# Altium schematic sheet power.SchDoc
size 381 x 241 mm; SheetNumber: 6; SheetTotal: 12
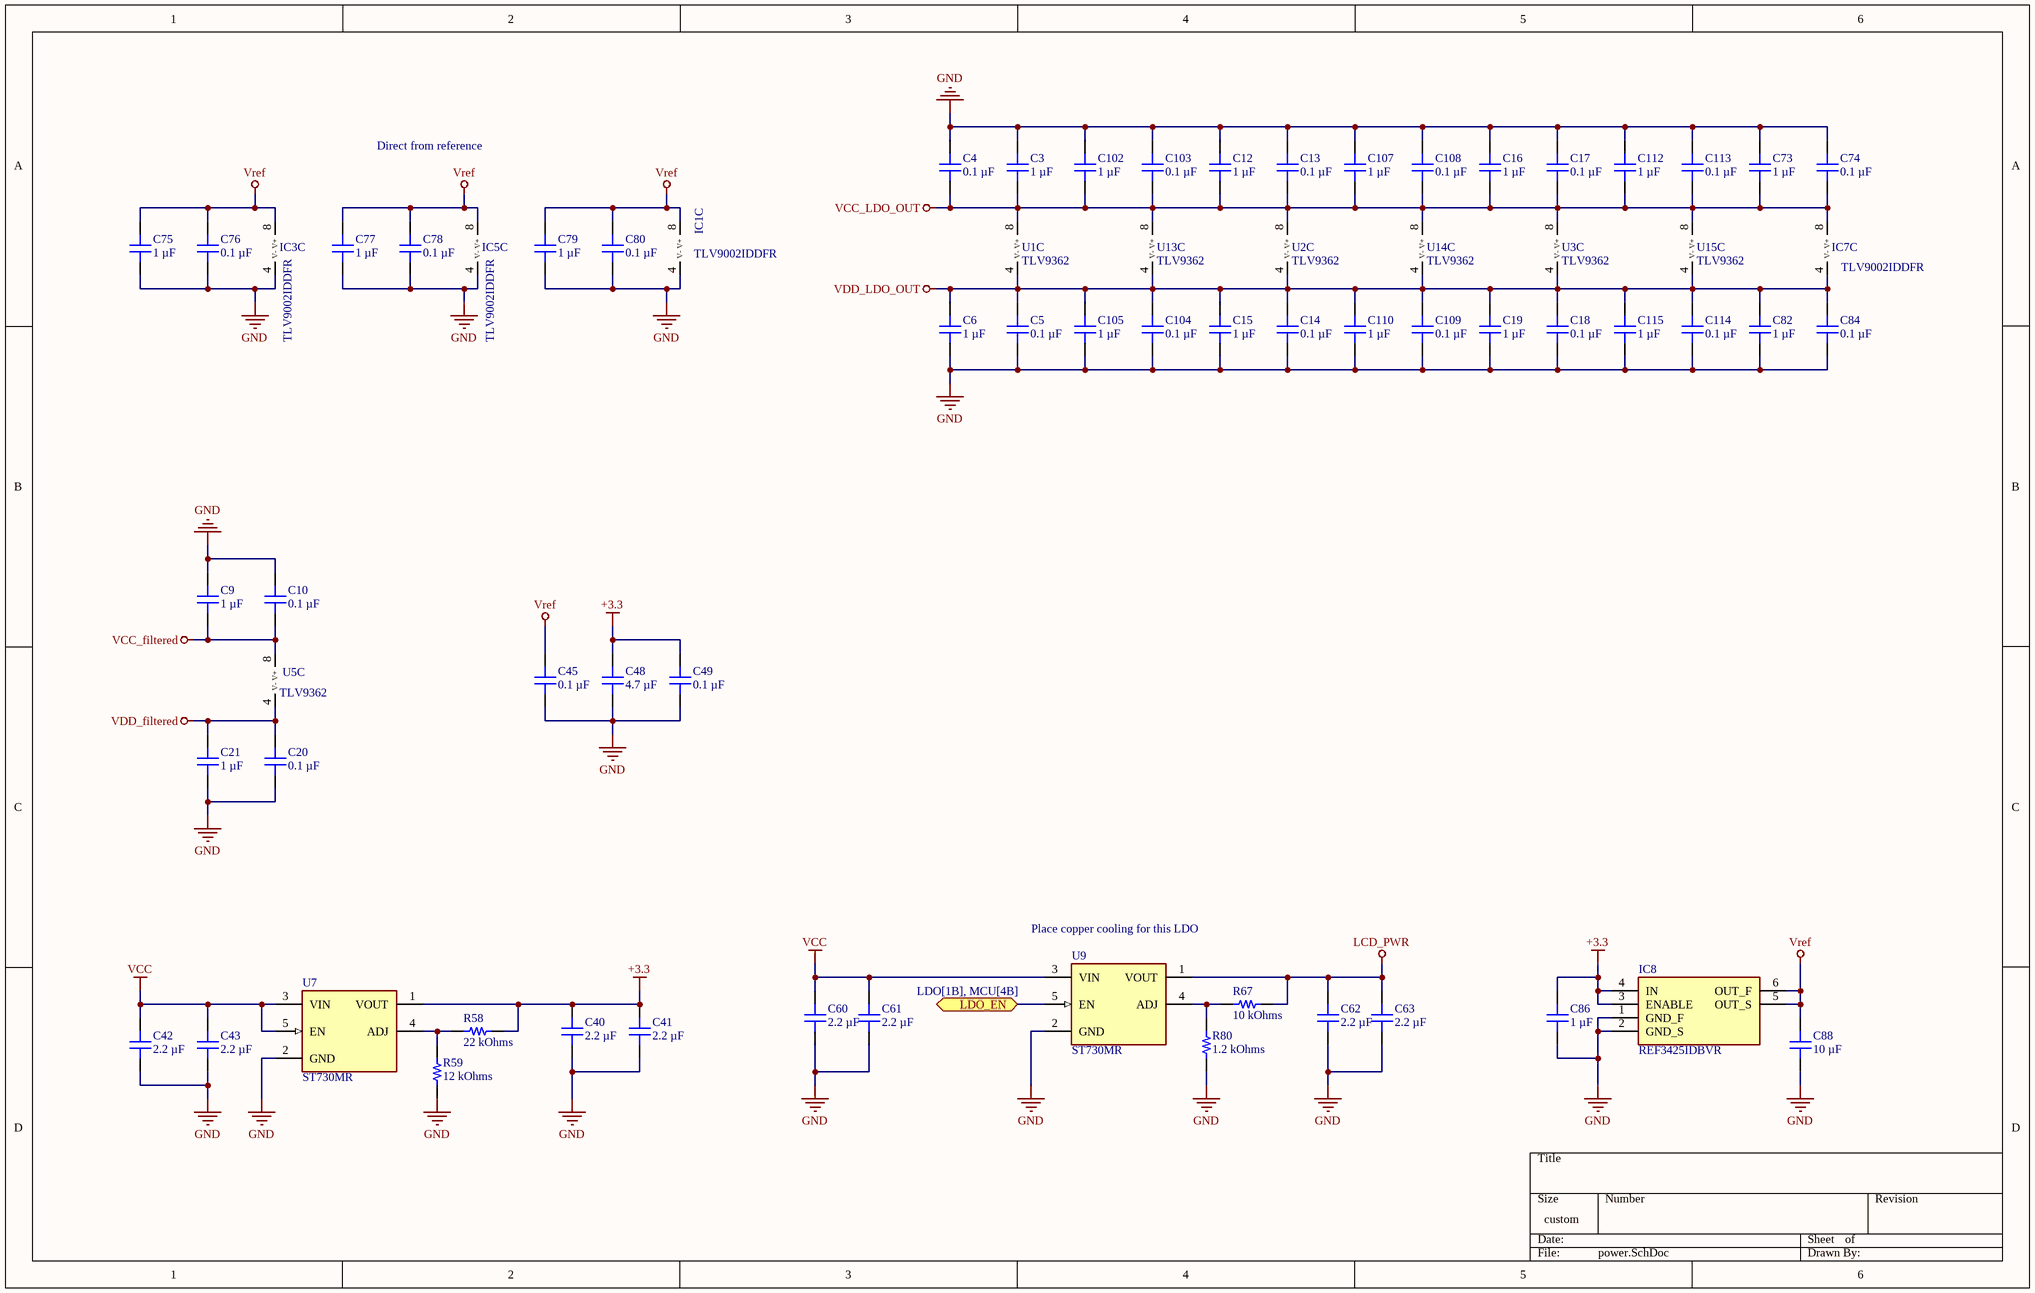
[diagram p0: power.SchDoc]

## Parts
C3  1 µF  [CAP 1206_3216 - 0.8MM]
C4  0.1 µF  [CAP 1206_3216 - 0.8MM]
C5  0.1 µF  [CAP 1206_3216 - 0.8MM]
C6  1 µF  [CAP 1206_3216 - 0.8MM]
C9  1 µF  [CAP 1206_3216 - 0.8MM]
C10  0.1 µF  [CAP 1206_3216 - 0.8MM]
C12  1 µF  [CAP 1206_3216 - 0.8MM]
C13  0.1 µF  [CAP 1206_3216 - 0.8MM]
C14  0.1 µF  [CAP 1206_3216 - 0.8MM]
C15  1 µF  [CAP 1206_3216 - 0.8MM]
C16  1 µF  [CAP 1206_3216 - 0.8MM]
C17  0.1 µF  [CAP 1206_3216 - 0.8MM]
C18  0.1 µF  [CAP 1206_3216 - 0.8MM]
C19  1 µF  [CAP 1206_3216 - 0.8MM]
C20  0.1 µF  [CAP 1206_3216 - 0.8MM]
C21  1 µF  [CAP 1206_3216 - 0.8MM]
C40  2.2 µF  [CAP 1206_3216 - 0.8MM]
C41  2.2 µF  [CAP 1206_3216 - 0.8MM]
C42  2.2 µF  [CAP 1206_3216 - 0.8MM]
C43  2.2 µF  [CAP 1206_3216 - 0.8MM]
C45  0.1 µF  [CAP 1206_3216 - 0.8MM]
C48  4.7 µF  [CAP 1206_3216 - 0.8MM]
C49  0.1 µF  [CAP 1206_3216 - 0.8MM]
C60  2.2 µF  [CAP 1206_3216 - 0.8MM]
C61  2.2 µF  [CAP 1206_3216 - 0.8MM]
C62  2.2 µF  [CAP 1206_3216 - 0.8MM]
C63  2.2 µF  [CAP 1206_3216 - 0.8MM]
C73  1 µF  [CAP 1206_3216 - 0.8MM]
C74  0.1 µF  [CAP 1206_3216 - 0.8MM]
C75  1 µF  [CAP 1206_3216 - 0.8MM]
C76  0.1 µF  [CAP 1206_3216 - 0.8MM]
C77  1 µF  [CAP 1206_3216 - 0.8MM]
C78  0.1 µF  [CAP 1206_3216 - 0.8MM]
C79  1 µF  [CAP 1206_3216 - 0.8MM]
C80  0.1 µF  [CAP 1206_3216 - 0.8MM]
C82  1 µF  [CAP 1206_3216 - 0.8MM]
C84  0.1 µF  [CAP 1206_3216 - 0.8MM]
C86  1 µF  [CAP 1206_3216 - 0.8MM]
C88  10 µF  [CAP 1206_3216 - 0.8MM]
C102  1 µF  [CAP 1206_3216 - 0.8MM]
C103  0.1 µF  [CAP 1206_3216 - 0.8MM]
C104  0.1 µF  [CAP 1206_3216 - 0.8MM]
C105  1 µF  [CAP 1206_3216 - 0.8MM]
C107  1 µF  [CAP 1206_3216 - 0.8MM]
C108  0.1 µF  [CAP 1206_3216 - 0.8MM]
C109  0.1 µF  [CAP 1206_3216 - 0.8MM]
C110  1 µF  [CAP 1206_3216 - 0.8MM]
C112  1 µF  [CAP 1206_3216 - 0.8MM]
C113  0.1 µF  [CAP 1206_3216 - 0.8MM]
C114  0.1 µF  [CAP 1206_3216 - 0.8MM]
C115  1 µF  [CAP 1206_3216 - 0.8MM]
IC1  TLV9002IDDFR  [SOT65P280X110-8N]  (part C of 3)
IC3  TLV9002IDDFR  [SOT65P280X110-8N]  (part C of 3)
IC5  TLV9002IDDFR  [SOT65P280X110-8N]  (part C of 3)
IC7  TLV9002IDDFR  [SOT65P280X110-8N]  (part C of 3)
IC8  REF3425IDBVR  [SOT95P280X145-6N]
R58  22 kOhms  [YAGEO RES 1206_3216]
R59  12 kOhms  [YAGEO RES 1206_3216]
R67  10 kOhms  [YAGEO RES 1206_3216]
R80  1.2 kOhms  [YAGEO RES 1206_3216]
U1  TLV9362  [SOIC8-127P600X175-8N]  (part C of 3)
U2  TLV9362  [SOIC8-127P600X175-8N]  (part C of 3)
U3  TLV9362  [SOIC8-127P600X175-8N]  (part C of 3)
U5  TLV9362  [SOIC8-127P600X175-8N]  (part C of 3)
U7  ST730MR  [FP-UJ-5-IPC_B]
U9  ST730MR  [FP-UJ-5-IPC_B]
U13  TLV9362  [SOIC8-127P600X175-8N]  (part C of 3)
U14  TLV9362  [SOIC8-127P600X175-8N]  (part C of 3)
U15  TLV9362  [SOIC8-127P600X175-8N]  (part C of 3)

## Ports
LDO_EN (bidir, see LDO[1B], MCU[4B])

## Nets
+3.3: C40.2 C41.2 C48.2 C49.2 C86.2 IC8.3(ENABLE) IC8.4(IN) R58.2 U7.1(VOUT)
GND: C3.1 C4.1 C5.2 C6.2 C9.2 C10.2 C12.2 C13.2 C14.2 C15.2 C16.2 C17.2 C18.2 C19.2 C20.1 C21.1 C40.1 C41.1 C42.1 C43.1 C45.1 C48.1 C49.1 C60.1 C61.1 C62.1 C63.1 C73.2 C74.2 C75.1 C76.1 C77.1 C78.1 C79.1 C80.1 C82.2 C84.2 C86.1 C88.1 C102.2 C103.2 C104.2 C105.2 C107.2 C108.2 C109.2 C110.2 C112.2 C113.2 C114.2 C115.2 IC1.4(V-) IC3.4(V-) IC5.4(V-) IC8.1(GND_F) IC8.2(GND_S) R59.2 R80.2 U7.2(GND) U9.2(GND)
LCD_PWR: C62.2 C63.2 R67.2 U9.1(VOUT)
VCC: C42.2 C43.2 C60.2 C61.2 U7.3(VIN) U7.5(EN) U9.3(VIN)
VCC_filtered: C9.1 C10.1 U5.8(V+)
VCC_LDO_OUT: C3.2 C4.2 C12.1 C13.1 C16.1 C17.1 C73.1 C74.1 C102.1 C103.1 C107.1 C108.1 C112.1 C113.1 IC7.8(V+) U1.8(V+) U2.8(V+) U3.8(V+) U13.8(V+) U14.8(V+) U15.8(V+)
VDD_filtered: C20.2 C21.2 U5.4(V-)
VDD_LDO_OUT: C5.1 C6.1 C14.1 C15.1 C18.1 C19.1 C82.1 C84.1 C104.1 C105.1 C109.1 C110.1 C114.1 C115.1 IC7.4(V-) U1.4(V-) U2.4(V-) U3.4(V-) U13.4(V-) U14.4(V-) U15.4(V-)
Vref: C45.2 C75.2 C76.2 C77.2 C78.2 C79.2 C80.2 C88.2 IC1.8(V+) IC3.8(V+) IC5.8(V+) IC8.5(OUT_S) IC8.6(OUT_F)
LDO_EN: U9.5(EN) ; port LDO_EN
NetR58_1: R58.1 R59.1 U7.4(ADJ)
NetR67_1: R67.1 R80.1 U9.4(ADJ)

## Notes on the sheet
- Direct from reference
- (near U9) Place copper cooling for this LDO

## Library data of the parts
C3 C6 C9 C12 C15 C16 C19 C21 C73 C75 C77 C79 C82 C86 C102 C105 C107 C110 C112 C115 = 885012208093: CAP CER 1UF 50V X7R 1206; manufacturer: Würth Elektronik; Tolerance: ±10%; Part Number: 885012208093; Capacitance: 1 µF; Applications: General Purpose; componentlink1description: Datasheet; componentlink1url: https://katalog.we-online.de/pbs/datasheet/885012208093.pdf; componentlink2description: DigiKey Link; componentlink2url: https://www.digikey.com/en/products/detail/würth-elektronik/885012208093/5453432; Device Package: 1206 (3216 Metric); lastupdated: 6/4/2024 19:10:33; Lifecycle Status: Active; Minimum Order: 1; Mounting Type: Surface Mount, MLCC; Operating Temperature: -55°C ~ 125°C; Package / Case: 1206 (3216 Metric); packaging: TapeAndReel; partid: 39665; Part Status: Active; price: 0.10; series: WCAP-CSGP; Size / Dimension: 0.126" L x 0.063" W (3.20mm x 1.60mm); Supplier 1: DigiKey; Supplier Part Number 1: 732-7577-1-ND; Temperature Coefficient: X7R; Thickness (Max): 0.075" (1.90mm); value: 1 µF; Voltage - Rated: 50V
C4 C5 C10 C13 C14 C17 C18 C20 C45 C49 C74 C76 C78 C80 C84 C103 C104 C108 C109 C113 C114 = 885012208087: CAP CER 0.1UF 50V X7R 1206; manufacturer: Würth Elektronik; Tolerance: ±10%; Part Number: 885012208087; Capacitance: 0.1 µF; Applications: General Purpose; componentlink1description: Datasheet; componentlink1url: https://katalog.we-online.de/pbs/datasheet/885012208087.pdf; componentlink2description: DigiKey Link; componentlink2url: https://www.digikey.com/en/products/detail/würth-elektronik/885012208087/5453982; Device Package: 1206 (3216 Metric); lastupdated: 6/4/2024 19:10:27; Lifecycle Status: Active; Minimum Order: 1; Mounting Type: Surface Mount, MLCC; Operating Temperature: -55°C ~ 125°C; Package / Case: 1206 (3216 Metric); packaging: TapeAndReel; partid: 20879; Part Status: Active; price: 0.06; series: WCAP-CSGP; Size / Dimension: 0.126" L x 0.063" W (3.20mm x 1.60mm); Supplier 1: DigiKey; Supplier Part Number 1: 732-8127-1-ND; Temperature Coefficient: X7R; Thickness (Max): 0.035" (0.90mm); value: 0.1 µF; Voltage - Rated: 50V
C40-C43 C60-C63 = 885382208001: CAP CER 2.2UF 25V X7R 1206; manufacturer: Würth Elektronik; Tolerance: ±10%; Part Number: 885382208001; Capacitance: 2.2 µF; Applications: Boardflex Sensitive; componentlink2description: DigiKey Link; componentlink2url: https://www.digikey.com/en/products/detail/würth-elektronik/885382208001/9816354; Device Package: 1206 (3216 Metric); Features: Soft Termination; lastupdated: 6/4/2024 19:10:38; Lifecycle Status: Active; Minimum Order: 1; Mounting Type: Surface Mount, MLCC; Operating Temperature: -55°C ~ 125°C; Package / Case: 1206 (3216 Metric); packaging: TapeAndReel; partid: 45904; Part Status: Active; price: 0.35; series: WCAP-CSST; Size / Dimension: 0.126" L x 0.063" W (3.20mm x 1.60mm); Supplier 1: DigiKey; Supplier Part Number 1: 732-13199-1-ND; Temperature Coefficient: X7R; Thickness (Max): 0.083" (2.10mm); value: 2.2 µF; Voltage - Rated: 25V
C48 = 885012208094: CAP CER 4.7UF 50V X7R 1206; manufacturer: Würth Elektronik; Tolerance: ±10%; Part Number: 885012208094; Capacitance: 4.7 µF; Applications: General Purpose; componentlink1description: Datasheet; componentlink1url: https://katalog.we-online.de/pbs/datasheet/885012208094.pdf; componentlink2description: DigiKey Link; componentlink2url: https://www.digikey.com/en/products/detail/würth-elektronik/885012208094/5453433; Device Package: 1206 (3216 Metric); lastupdated: 6/4/2024 19:10:35; Lifecycle Status: Active; Minimum Order: 1; Mounting Type: Surface Mount, MLCC; Operating Temperature: -55°C ~ 125°C; Package / Case: 1206 (3216 Metric); packaging: TapeAndReel; partid: 31399; Part Status: Active; price: 0.36; series: WCAP-CSGP; Size / Dimension: 0.126" L x 0.063" W (3.20mm x 1.60mm); Supplier 1: DigiKey; Supplier Part Number 1: 732-7578-1-ND; Temperature Coefficient: X7R; Thickness (Max): 0.075" (1.90mm); value: 4.7 µF; Voltage - Rated: 50V
C88 = 885012208069: CAP CER 10UF 25V X7R 1206; manufacturer: Würth Elektronik; Tolerance: ±10%; Part Number: 885012208069; Capacitance: 10 µF; Applications: General Purpose; componentlink1description: Datasheet; componentlink1url: https://katalog.we-online.de/pbs/datasheet/885012208069.pdf; componentlink2description: DigiKey Link; componentlink2url: https://www.digikey.com/en/products/detail/würth-elektronik/885012208069/5453429; Device Package: 1206 (3216 Metric); lastupdated: 6/4/2024 19:10:32; Lifecycle Status: Active; Minimum Order: 1; Mounting Type: Surface Mount, MLCC; Operating Temperature: -55°C ~ 125°C; Package / Case: 1206 (3216 Metric); packaging: TapeAndReel; partid: 43199; Part Status: Active; price: 0.40; series: WCAP-CSGP; Size / Dimension: 0.126" L x 0.063" W (3.20mm x 1.60mm); Supplier 1: DigiKey; Supplier Part Number 1: 732-7574-1-ND; Temperature Coefficient: X7R; Thickness (Max): 0.075" (1.90mm); value: 10 µF; Voltage - Rated: 25V
IC1 IC3 IC5 IC7 = TLV9002IDDFR: Integrated Circuit; Manufacturer_Name: Texas Instruments; Datasheet Link: https://www.ti.com/lit/gpn/TLV9002; Height: 1.1mm; Manufacturer_Part_Number: TLV9002IDDFR; Mouser Part Number: 595-TLV9002IDDFR; Mouser Price/Stock: https://www.mouser.co.uk/ProductDetail/Texas-Instruments/TLV9002IDDFR?qs=mAH9sUMRCtuVJ6NmNV%252Bgrw%3D%3D; Arrow Part Number: TLV9002IDDFR; Arrow Price/Stock: https://www.arrow.com/en/products/tlv9002iddfr/texas-instruments?utm_currency=USD&region=nac
IC8 = REF3425IDBVR: Integrated Circuit; Manufacturer_Name: Texas Instruments; Datasheet Link: http://www.ti.com/lit/ds/symlink/ref3425.pdf; Height: 1.45mm; Manufacturer_Part_Number: REF3425IDBVR; Mouser Part Number: 595-REF3425IDBVR; Mouser Price/Stock: https://www.mouser.co.uk/ProductDetail/Texas-Instruments/REF3425IDBVR?qs=YCa%2FAAYMW01YJo5s3bO8wA%3D%3D; Arrow Part Number: REF3425IDBVR; Arrow Price/Stock: https://www.arrow.com/en/products/ref3425idbvr/texas-instruments?region=nac
R58 = RT1206FRE0722KL: RES SMD 22K OHM 1% 1/4W 1206; Manufacturer: Yageo; Power (Watts): 0.25W, 1/4W; Temperature Coefficient: ±50ppm/°C; Part Number: RT1206FRE0722KL; ComponentLink1Description: Datasheet; ComponentLink1URL: https://www.yageo.com/upload/media/product/productsearch/datasheet/rchip/PYu-RT_1-to-0.01_RoHS_L_12.pdf; ComponentLink2Description: DigiKey Link; ComponentLink2URL: https://www.digikey.com/en/products/detail/yageo/RT1206FRE0722KL/1083042; Composition: Thin Film; Device Package: 1206 (3216 Metric); Height - Seated (Max): 0.026" (0.65mm); LastUpdated: 7/25/2024 09:21:19; Lifecycle Status: Active; Minimum Order: 1; Number of Terminations: 2; Operating Temperature: -55°C ~ 155°C; Package / Case: 1206 (3216 Metric); Packaging: TapeAndReel; PartId: 69172; Price: 0.01; Resistance: 22 kOhms; Series: RT; Size / Dimension: 0.122" L x 0.063" W (3.10mm x 1.60mm); Supplier 1: DigiKey; Supplier Part Number 1: 13-RT1206FRE0722KLCT-ND; Supplier Device Package: 1206; Tolerance: ±1%; Value: 22 kOhms; Part Status: Active
R59 = RT1206FRE0712KL: RES SMD 12K OHM 1% 1/4W 1206; Manufacturer: Yageo; Power (Watts): 0.25W, 1/4W; Temperature Coefficient: ±50ppm/°C; Part Number: RT1206FRE0712KL; ComponentLink1Description: Datasheet; ComponentLink1URL: https://www.yageo.com/upload/media/product/productsearch/datasheet/rchip/PYu-RT_1-to-0.01_RoHS_L_12.pdf; ComponentLink2Description: DigiKey Link; ComponentLink2URL: https://www.digikey.com/en/products/detail/yageo/RT1206FRE0712KL/1082900; Composition: Thin Film; Device Package: 1206 (3216 Metric); Height - Seated (Max): 0.026" (0.65mm); LastUpdated: 7/25/2024 09:21:22; Lifecycle Status: Active; Minimum Order: 1; Number of Terminations: 2; Operating Temperature: -55°C ~ 155°C; Package / Case: 1206 (3216 Metric); Packaging: TapeAndReel; PartId: 58377; Part Status: Active; Price: 0.01; Resistance: 12 kOhms; Series: RT; Size / Dimension: 0.122" L x 0.063" W (3.10mm x 1.60mm); Supplier 1: DigiKey; Supplier Part Number 1: 13-RT1206FRE0712KLCT-ND; Supplier Device Package: 1206; Tolerance: ±1%; Value: 12 kOhms
R67 = RT1206FRE0710KL: RES SMD 10K OHM 1% 1/4W 1206; Manufacturer: Yageo; Power (Watts): 0.25W, 1/4W; Temperature Coefficient: ±50ppm/°C; Part Number: RT1206FRE0710KL; ComponentLink1Description: Datasheet; ComponentLink1URL: https://www.yageo.com/upload/media/product/productsearch/datasheet/rchip/PYu-RT_1-to-0.01_RoHS_L_11.pdf; ComponentLink2Description: DigiKey Link; ComponentLink2URL: https://www.digikey.com/en/products/detail/yageo/RT1206FRE0710KL/1082868; Composition: Thin Film; Device Package: 1206 (3216 Metric); Height - Seated (Max): 0.026" (0.65mm); LastUpdated: 7/25/2024 09:21:28; Lifecycle Status: Active; Minimum Order: 1; Number of Terminations: 2; Operating Temperature: -55°C ~ 155°C; Package / Case: 1206 (3216 Metric); Packaging: TapeAndReel; PartId: 38903; Part Status: Active; Price: 0.01; Resistance: 10 kOhms; Series: RT; Size / Dimension: 0.122" L x 0.063" W (3.10mm x 1.60mm); Supplier 1: DigiKey; Supplier Part Number 1: YAG1242CT-ND; Supplier Device Package: 1206; Tolerance: ±1%; Value: 10 kOhms
R80 = RT1206FRE071K2L: RES SMD 1.2K OHM 1% 1/4W 1206; Manufacturer: Yageo; Power (Watts): 0.25W, 1/4W; Temperature Coefficient: ±50ppm/°C; Part Number: RT1206FRE071K2L; ComponentLink1Description: Datasheet; ComponentLink1URL: https://www.yageo.com/upload/media/product/productsearch/datasheet/rchip/PYu-RT_1-to-0.01_RoHS_L_12.pdf; ComponentLink2Description: DigiKey Link; ComponentLink2URL: https://www.digikey.com/en/products/detail/yageo/RT1206FRE071K2L/1082995; Composition: Thin Film; Device Package: 1206 (3216 Metric); Height - Seated (Max): 0.026" (0.65mm); LastUpdated: 7/25/2024 09:21:22; Lifecycle Status: Active; Minimum Order: 1; Number of Terminations: 2; Operating Temperature: -55°C ~ 155°C; Package / Case: 1206 (3216 Metric); Packaging: TapeAndReel; PartId: 58383; Part Status: Active; Price: 0.01; Resistance: 1.2 kOhms; Series: RT; Size / Dimension: 0.122" L x 0.063" W (3.10mm x 1.60mm); Supplier 1: DigiKey; Supplier Part Number 1: 13-RT1206FRE071K2LCT-ND; Supplier Device Package: 1206; Tolerance: ±1%; Value: 1.2 kOhms
U1-U3 U5 U13-U15 = TLV9362: TLV936x 10-MHz, 40-V, RRO, Operational Amplifie; ComponentLink1Description: Datasheet; ComponentLink1URL: https://www.ti.com/lit/ds/symlink/tlv9362.pdf